# Altium schematic sheet Power.SchDoc
size A; DocumentNumber: 1; SheetNumber: 1; SheetTotal: 6
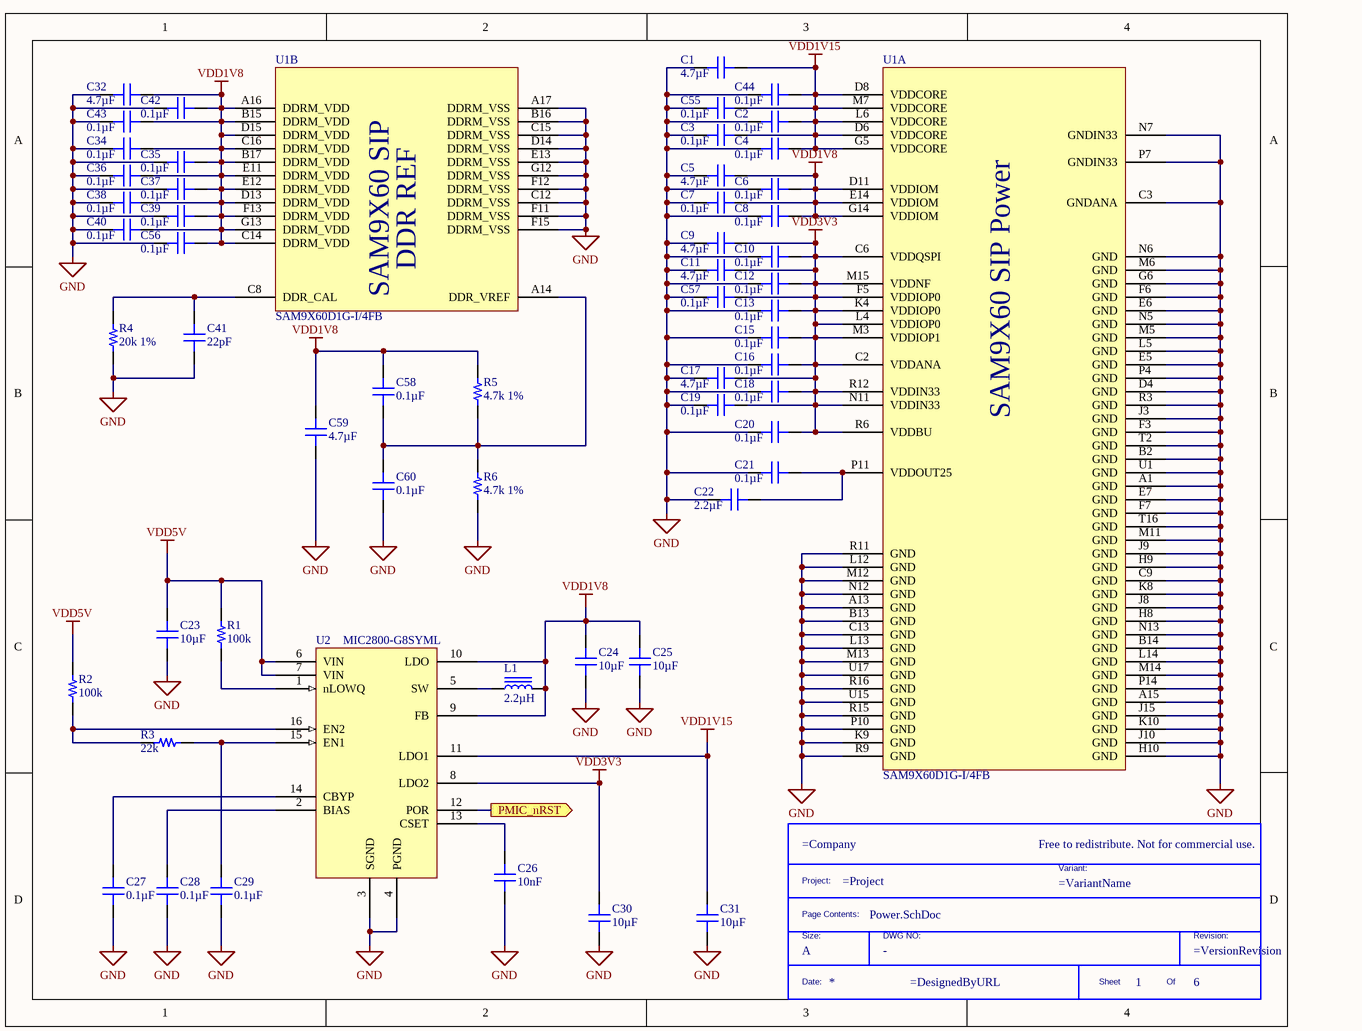
[diagram p0: Power.SchDoc]

## Parts
*  Size: A  (hidden comment: TitleBlock)  (graphical)
C1  4.7µF  [CAP 0402_1005]
C2  0.1µF  [CAP 0402_1005]
C3  0.1µF  [CAP 0402_1005]
C4  0.1µF  [CAP 0402_1005]
C5  4.7µF  [CAP 0402_1005]
C6  0.1µF  [CAP 0402_1005]
C7  0.1µF  [CAP 0402_1005]
C8  0.1µF  [CAP 0402_1005]
C9  4.7µF  [CAP 0402_1005]
C10  0.1µF  [CAP 0402_1005]
C11  4.7µF  [CAP 0402_1005]
C12  0.1µF  [CAP 0402_1005]
C13  0.1µF  [CAP 0402_1005]
C15  0.1µF  [CAP 0402_1005]
C16  0.1µF  [CAP 0402_1005]
C17  4.7µF  [CAP 0402_1005]
C18  0.1µF  [CAP 0402_1005]
C19  0.1µF  [CAP 0402_1005]
C20  0.1µF  [CAP 0402_1005]
C21  0.1µF  [CAP 0402_1005]
C22  2.2µF  [CAP 0402_1005]
C23  10µF  [CAP 0805_2012]
C24  10µF  [CAP 0805_2012]
C25  10µF  [CAP 0805_2012]
C26  10nF  [CAP 0402_1005]
C27  0.1µF  [CAP 0402_1005]
C28  0.1µF  [CAP 0402_1005]
C29  0.1µF  [CAP 0402_1005]
C30  10µF  [CAP 0805_2012]
C31  10µF  [CAP 0805_2012]
C32  4.7µF  [CAP 0402_1005]
C34  0.1µF  [CAP 0402_1005]
C35  0.1µF  [CAP 0402_1005]
C36  0.1µF  [CAP 0402_1005]
C37  0.1µF  [CAP 0402_1005]
C38  0.1µF  [CAP 0402_1005]
C39  0.1µF  [CAP 0402_1005]
C40  0.1µF  [CAP 0402_1005]
C41  22pF  [CAP 0402_1005]
C42  0.1µF  [CAP 0402_1005]
C43  0.1µF  [CAP 0402_1005]
C44  0.1µF  [CAP 0402_1005]
C55  0.1µF  [CAP 0402_1005]
C56  0.1µF  [CAP 0402_1005]
C57  0.1µF  [CAP 0402_1005]
C58  0.1µF  [CAP 0402_1005]
C59  4.7µF  [CAP 0402_1005]
C60  0.1µF  [CAP 0402_1005]
L1  2.2µH  [IND 0806_2016]
R1  100k  [RES 0402_1005]
R2  100k  [RES 0402_1005]
R3  22k  [RES 0402_1005]
R4  20k 1%  [RES 0402_1005]
R5  4.7k 1%  [RES 0402_1005]
R6  4.7k 1%  [RES 0402_1005]
U1  SAM9X60D1G-I/4FB  [BGA233C80P17X17_1400X1400X120]  (parts A,B of 7)
U2  MIC2800-G8SYML  [QFN50P300X300X90-16N]

## Ports
PMIC_nRST (out)

## Nets
GND: C1.1 C2.2 C3.2 C4.2 C5.1 C6.2 C7.2 C8.2 C9.1 C10.2 C11.1 C12.2 C13.2 C15.2 C16.2 C17.1 C18.2 C19.2 C20.2 C21.2 C22.2 C23.1 C24.1 C25.1 C26.1 C27.1 C28.1 C29.1 C30.1 C31.1 C32.1 C34.2 C35.2 C36.2 C37.2 C38.2 C39.2 C40.2 C41.1 C42.2 C43.2 C44.2 C55.2 C56.2 C57.2 C59.1 C60.2 R4.1 R6.1 U1.A1(GND) U1.A13(GND) U1.A15(GND) U1.A17(DDRM_VSS) U1.B2(GND) U1.B13(GND) U1.B14(GND) U1.B16(DDRM_VSS) U1.C3(GNDANA) U1.C9(GND) U1.C12(DDRM_VSS) U1.C13(GND) U1.C15(DDRM_VSS) U1.D4(GND) U1.D14(DDRM_VSS) U1.E5(GND) U1.E6(GND) U1.E7(GND) U1.E13(DDRM_VSS) U1.F3(GND) U1.F6(GND) U1.F7(GND) U1.F11(DDRM_VSS) U1.F12(DDRM_VSS) U1.F15(DDRM_VSS) U1.G6(GND) U1.G12(DDRM_VSS) U1.H8(GND) U1.H9(GND) U1.H10(GND) U1.J3(GND) U1.J8(GND) U1.J9(GND) U1.J10(GND) U1.J15(GND) U1.K8(GND) U1.K9(GND) U1.K10(GND) U1.L5(GND) U1.L12(GND) U1.L13(GND) U1.L14(GND) U1.M5(GND) U1.M6(GND) U1.M11(GND) U1.M12(GND) U1.M13(GND) U1.M14(GND) U1.N5(GND) U1.N6(GND) U1.N7(GNDIN33) U1.N12(GND) U1.N13(GND) U1.P4(GND) U1.P7(GNDIN33) U1.P10(GND) U1.P14(GND) U1.R3(GND) U1.R9(GND) U1.R11(GND) U1.R15(GND) U1.R16(GND) U1.T2(GND) U1.T16(GND) U1.U1(GND) U1.U15(GND) U1.U17(GND) U2.3(SGND) U2.4(PGND)
VDD1V8: C5.2 C6.1 C7.1 C8.1 C24.2 C25.2 C32.2 C34.1 C35.1 C36.1 C37.1 C38.1 C39.1 C40.1 C42.1 C43.1 C56.1 C58.1 C59.2 L1.2 R5.2 U1.A16(DDRM_VDD) U1.B15(DDRM_VDD) U1.B17(DDRM_VDD) U1.C14(DDRM_VDD) U1.C16(DDRM_VDD) U1.D11(VDDIOM) U1.D13(DDRM_VDD) U1.D15(DDRM_VDD) U1.E11(DDRM_VDD) U1.E12(DDRM_VDD) U1.E14(VDDIOM) U1.F13(DDRM_VDD) U1.G13(DDRM_VDD) U1.G14(VDDIOM) U2.9(FB) U2.10(LDO)
VDD1V15: C1.2 C2.1 C3.1 C4.1 C31.2 C44.1 C55.1 U1.D6(VDDCORE) U1.D8(VDDCORE) U1.G5(VDDCORE) U1.L6(VDDCORE) U1.M7(VDDCORE) U2.11(LDO1)
VDD3V3: C9.2 C10.1 C11.2 C12.1 C13.1 C15.1 C16.1 C17.2 C18.1 C19.1 C20.1 C30.2 C57.1 U1.C2(VDDANA) U1.C6(VDDQSPI) U1.F5(VDDIOP0) U1.K4(VDDIOP0) U1.L4(VDDIOP0) U1.M3(VDDIOP1) U1.M15(VDDNF) U1.N11(VDDIN33) U1.R6(VDDBU) U1.R12(VDDIN33) U2.8(LDO2)
VDD5V: C23.2 R1.2 R2.2 U2.6(VIN) U2.7(VIN)
PMIC_nRST: U2.12(POR) ; port PMIC_nRST
NetC21_1: C21.1 C22.1 U1.P11(VDDOUT25)
NetC26_2: C26.2 U2.13(CSET)
NetC27_2: C27.2 U2.14(CBYP)
NetC28_2: C28.2 U2.2(BIAS)
NetC29_2: C29.2 R3.1 U2.15(EN1)
NetC41_2: C41.2 R4.2 U1.C8(DDR_CAL)
NetC58_2: C58.2 C60.1 R5.1 R6.2 U1.A14(DDR_VREF)
NetL1_1: L1.1 U2.5(SW)
NetR1_1: R1.1 U2.1(nLOWQ)
NetR2_1: R2.1 R3.2 U2.16(EN2)

## Notes on the sheet
- (in symbol SAM9X60D1G-I/4FB, part A) SAM9X60 SIP Power
- (in symbol SAM9X60D1G-I/4FB, part B) DDR REF; SAM9X60 SIP
- (in symbol TitleBlock) Free to redistribute. Not for commercial use.; Project:; Variant:; Page Contents:; Size:; DWG NO:; Revision:; Date:; Sheet; Of

## Library data of the parts
* = TitleBlock: Custom Title Block; DWG: -
C1 C5 C9 C11 C17 C32 C59 = CL05A475KP5NRNC: CAP CER 4.7UF 10V X5R 0402; Manufacturer: Samsung Electro-Mechanics; Tolerance: ±10%; Part Number: CL05A475KP5NRNC; Value: 4.7µF; Applications: General Purpose; Capacitance: 4.7µF; ComponentLink1Description: Datasheet; ComponentLink1URL: http://www.samsungsem.com/kr/support/product-search/mlcc/CL05A475KP5NRNC.jsp; ComponentLink2Description: DigiKey Link; ComponentLink2URL: http://digikey.com/product-detail/en/samsung-electro-mechanics/CL05A475KP5NRNC/1276-1480-1-ND/3889566; Device Package: 0402 (1005 Metric); LastUpdated: 9/2/2020 1:02:23 AM; Lifecycle Status: Active; Minimum Order: 1; Mounting Type: Surface Mount, MLCC; Operating Temperature: -55°C ~ 85°C; Package / Case: 0402 (1005 Metric); Packaging: TapeAndReel; PartId: 2191; Part Status: Active; Price: 0.08; Series: CL; Size / Dimension: 0.039" L x 0.020" W (1.00mm x 0.50mm); Supplier 1: DigiKey; Supplier Part Number 1: 1276-1480-1-ND; Temperature Coefficient: X5R; Thickness (Max): 0.022" (0.55mm); Voltage - Rated: 10V
C2-C4 C6-C8 C10 C12 C13 C15 C16 C18-C21 C27-C29 C34-C40 C42-C44 C55-C58 C60 = C0402C104K4PACTU: CAP CER 0.1UF 16V X5R 0402; Manufacturer: KEMET; Tolerance: ±10%; Part Number: C0402C104K4PACTU; Value: 0.1µF; Applications: General Purpose; Capacitance: 0.1µF; ComponentLink1Description: Datasheet; ComponentLink1URL: https://api.kemet.com/component-edge/download/datasheet/C0402C104K4PACTU.pdf; ComponentLink2Description: DigiKey Link; ComponentLink2URL: http://digikey.com/product-detail/en/kemet/C0402C104K4PACTU/399-7762-1-ND/3471485; Device Package: 0402 (1005 Metric); LastUpdated: 9/2/2020 1:02:03 AM; Lifecycle Status: Active; Minimum Order: 1; Mounting Type: Surface Mount, MLCC; Operating Temperature: -55°C ~ 85°C; Package / Case: 0402 (1005 Metric); Packaging: TapeAndReel; PartId: 11334; Part Status: Active; Price: 0.01; Series: SMD Comm X5R; Size / Dimension: 0.039" L x 0.020" W (1.00mm x 0.50mm); Supplier 1: DigiKey; Supplier Part Number 1: 399-7762-1-ND; Temperature Coefficient: X5R; Thickness (Max): 0.022" (0.55mm); Voltage - Rated: 16V
C22 = C1005X5R1A225K050BC: CAP CER 2.2UF 10V X5R 0402; Manufacturer: TDK Corporation; Tolerance: ±10%; Part Number: C1005X5R1A225K050BC; Value: 2.2µF; Applications: General Purpose; Capacitance: 2.2µF; ComponentLink1Description: Datasheet; ComponentLink1URL: https://product.tdk.com/info/en/catalog/datasheets/mlcc_commercial_general_en.pdf?ref_disty=digikey; ComponentLink2Description: DigiKey Link; ComponentLink2URL: http://digikey.com/product-detail/en/tdk-corporation/C1005X5R1A225K050BC/445-7392-1-ND/2733464; Device Package: 0402 (1005 Metric); Features: Low ESL; LastUpdated: 9/2/2020 1:02:23 AM; Lifecycle Status: Active; Minimum Order: 1; Mounting Type: Surface Mount, MLCC; Operating Temperature: -55°C ~ 85°C; Package / Case: 0402 (1005 Metric); Packaging: TapeAndReel; PartId: 2144; Part Status: Active; Price: 0.07; Series: C; Size / Dimension: 0.039" L x 0.020" W (1.00mm x 0.50mm); Supplier 1: DigiKey; Supplier Part Number 1: 445-7392-1-ND; Temperature Coefficient: X5R; Thickness (Max): 0.022" (0.55mm); Voltage - Rated: 10V
C23-C25 C30 C31 = CL21A106KPCLQNC: CAP CER 10UF 10V X5R 0805; Manufacturer: Samsung Electro-Mechanics; Tolerance: ±10%; Part Number: CL21A106KPCLQNC; Value: 10µF; Applications: General Purpose; Capacitance: 10µF; ComponentLink1Description: Datasheet; ComponentLink1URL: http://www.samsungsem.com/kr/support/product-search/mlcc/CL21A106KPCLQNC.jsp; ComponentLink2Description: DigiKey Link; ComponentLink2URL: http://digikey.com/product-detail/en/samsung-electro-mechanics/CL21A106KPCLQNC/1276-2402-1-ND/3890488; Device Package: 0805 (2012 Metric); LastUpdated: 9/2/2020 1:04:19 AM; Lifecycle Status: Active; Minimum Order: 1; Mounting Type: Surface Mount, MLCC; Operating Temperature: -55°C ~ 85°C; Package / Case: 0805 (2012 Metric); Packaging: TapeAndReel; PartId: 14319; Part Status: Active; Price: 0.03; Series: CL; Size / Dimension: 0.079" L x 0.049" W (2.00mm x 1.25mm); Supplier 1: DigiKey; Supplier Part Number 1: 1276-2402-1-ND; Temperature Coefficient: X5R; Thickness (Max): 0.037" (0.95mm); Voltage - Rated: 10V
C26 = C0402C103K4RECAUTO: CAP CER 0402 10NF 16V X7R 10%; Manufacturer: KEMET; Capacitance: 10000pF; Part Number: C0402C103K4RECAUTO; Value: 10nF; Applications: Automotive, ESD Protection; ComponentLink1Description: Datasheet; ComponentLink1URL: https://api.kemet.com/component-edge/download/datasheet/C0402C103K4RECAUTO.pdf; ComponentLink2Description: DigiKey Link; ComponentLink2URL: http://digikey.com/product-detail/en/kemet/C0402C103K4RECAUTO/399-17876-1-ND/8640543; Device Package: 0402 (1005 Metric); LastUpdated: 9/2/2020 1:02:25 AM; Lifecycle Status: Active; Minimum Order: 1; Mounting Type: Surface Mount, MLCC; Operating Temperature: -55°C ~ 125°C; Package / Case: 0402 (1005 Metric); Packaging: TapeAndReel; PartId: 1725; Part Status: Active; Price: 0.02; Ratings: AEC-Q200; Series: ESD SMD Auto X7R; Size / Dimension: 0.039" L x 0.020" W (1.00mm x 0.50mm); Supplier 1: DigiKey; Supplier Part Number 1: 399-17876-1-ND; Temperature Coefficient: X7R; Thickness (Max): 0.022" (0.55mm); Tolerance: ±10%; Voltage - Rated: 16V
C41 = 0402N220F500CT: CAP CER 22PF 50V C0G/NP0 0402; Manufacturer: Walsin Technology Corporation; Temperature Coefficient: C0G, NP0; Tolerance: ±1%; Part Number: 0402N220F500CT; Value: 22pF; Applications: General Purpose; Capacitance: 22pF; ComponentLink1Description: Datasheet; ComponentLink1URL: http://www.passivecomponent.com/wp-content/uploads/2018/10/MLCC.pdf; ComponentLink2Description: DigiKey Link; ComponentLink2URL: http://digikey.com/product-detail/en/walsin-technology-corporation/0402N220F500CT/1292-1280-1-ND/9355284; Device Package: 0402 (1005 Metric); LastUpdated: 9/2/2020 1:02:14 AM; Lifecycle Status: Active; Minimum Order: 1; Mounting Type: Surface Mount, MLCC; Operating Temperature: -55°C ~ 125°C; Package / Case: 0402 (1005 Metric); Packaging: TapeAndReel; PartId: 6200; Part Status: Active; Price: 0.01; Series: -; Size / Dimension: 0.039" L x 0.020" W (1.00mm x 0.50mm); Supplier 1: DigiKey; Supplier Part Number 1: 1292-1280-1-ND; Thickness (Max): 0.022" (0.55mm); Voltage - Rated: 50V
L1 = CIGT201610EH2R2MNE: FIXED IND 2.2UH 2.5A 87MOHM SMD; Manufacturer: Samsung Electro-Mechanics; Current - Saturation: 2.9A; DC Resistance (DCR): 87mOhm Max; Inductance Frequency - Test: 1MHz; Material - Core: Metal Composite; Shielding: Unshielded; Tolerance: ±20%; Type: Thin Film; Part Number: CIGT201610EH2R2MNE; ComponentLink1Description: Datasheet; ComponentLink1URL: http://www.samsungsem.com/kr/support/product-search/inductor/CIGT201610EH2R2MNE.jsp; ComponentLink2Description: DigiKey Link; ComponentLink2URL: http://digikey.com/product-detail/en/samsung-electro-mechanics/CIGT201610EH2R2MNE/1276-6901-1-ND/7041301; Current Rating (Amps): 2.5A; Device Package: 0806 (2016 Metric); Height - Seated (Max): 0.039" (1.00mm); Inductance: 2.2µH; LastUpdated: 9/2/2020 1:24:36 AM; Lifecycle Status: Active; Minimum Order: 1; Mounting Type: Surface Mount; Operating Temperature: -40°C ~ 125°C; Package / Case: 0806 (2016 Metric); Packaging: TapeAndReel; PartId: 3766; Part Status: Active; Price: 0.11; Series: CIGT; Size / Dimension: 0.079" L x 0.063" W (2.00mm x 1.60mm); Supplier 1: DigiKey; Supplier Part Number 1: 1276-6901-1-ND; Supplier Device Package: 0806 (2016 Metric); Value: 2.2µH
R1 R2 = CRCW0402100KFKEDC: RES SMD 100K OHM 1% 1/16W 0402; Manufacturer: Vishay Dale; Power (Watts): 0.063W, 1/16W; Resistance: 100 kOhms; Temperature Coefficient: ±100ppm/°C; Part Number: CRCW0402100KFKEDC; Value: 100k; ComponentLink1Description: Datasheet; ComponentLink1URL: http://www.vishay.com/docs/28773/crcwce3.pdf; ComponentLink2Description: DigiKey Link; ComponentLink2URL: http://digikey.com/product-detail/en/vishay-dale/CRCW0402100KFKEDC/541-3960-1-ND/7928643; Composition: Thick Film; Device Package: 0402 (1005 Metric); Height - Seated (Max): 0.014" (0.35mm); LastUpdated: 9/2/2020 1:07:49 AM; Lifecycle Status: Active; Minimum Order: 1; Number of Terminations: 2; Operating Temperature: -55°C ~ 155°C; Package / Case: 0402 (1005 Metric); Packaging: CutTape; PartId: 12665; Part Status: Active; Price: 0.10; Series: CRCW-C; Size / Dimension: 0.039" L x 0.020" W (1.00mm x 0.50mm); Supplier 1: DigiKey; Supplier Part Number 1: 541-3960-1-ND; Supplier Device Package: 0402; Tolerance: ±1%
R3 = CR0402-FX-2202GLF: RES SMD 22K OHM 1% 1/16W 0402; Manufacturer: Bourns Inc.; Power (Watts): 0.063W, 1/16W; Resistance: 22 kOhms; Temperature Coefficient: ±100ppm/°C; Part Number: CR0402-FX-2202GLF; Value: 22k; ComponentLink1Description: Datasheet; ComponentLink1URL: https://www.bourns.com/docs/Product-Datasheets/CR0402.pdf; ComponentLink2Description: DigiKey Link; ComponentLink2URL: http://digikey.com/product-detail/en/bourns-inc/CR0402-FX-2202GLF/CR0402-FX-2202GLFCT-ND/4247665; Composition: Thick Film; Device Package: 0402 (1005 Metric); Height - Seated (Max): 0.016" (0.40mm); LastUpdated: 9/2/2020 1:08:01 AM; Lifecycle Status: Active; Minimum Order: 1; Number of Terminations: 2; Operating Temperature: -55°C ~ 155°C; Package / Case: 0402 (1005 Metric); Packaging: CutTape; PartId: 6638; Part Status: Active; Price: 0.10; Series: CR0402; Size / Dimension: 0.039" L x 0.020" W (1.00mm x 0.50mm); Supplier 1: DigiKey; Supplier Part Number 1: CR0402-FX-2202GLFCT-ND; Supplier Device Package: 0402; Tolerance: ±1%
R4 = CR0402-FX-2002GLF: RES SMD 20K OHM 1% 1/16W 0402; Manufacturer: Bourns Inc.; Power (Watts): 0.063W, 1/16W; Resistance: 20 kOhms; Temperature Coefficient: ±100ppm/°C; Part Number: CR0402-FX-2002GLF; Value: 20k 1%; ComponentLink1Description: Datasheet; ComponentLink1URL: https://www.bourns.com/docs/Product-Datasheets/CR0402.pdf; ComponentLink2Description: DigiKey Link; ComponentLink2URL: http://digikey.com/product-detail/en/bourns-inc/CR0402-FX-2002GLF/CR0402-FX-2002GLFCT-ND/3740845; Composition: Thick Film; Device Package: 0402 (1005 Metric); Height - Seated (Max): 0.016" (0.40mm); LastUpdated: 9/2/2020 1:08:01 AM; Lifecycle Status: Active; Minimum Order: 1; Number of Terminations: 2; Operating Temperature: -55°C ~ 155°C; Package / Case: 0402 (1005 Metric); Packaging: CutTape; PartId: 6612; Part Status: Active; Price: 0.10; Series: CR0402; Size / Dimension: 0.039" L x 0.020" W (1.00mm x 0.50mm); Supplier 1: DigiKey; Supplier Part Number 1: CR0402-FX-2002GLFCT-ND; Supplier Device Package: 0402; Tolerance: ±1%
R5 R6 = CR0402-FX-4701GLF: RES SMD 4.7K OHM 1% 1/16W 0402; Manufacturer: Bourns Inc.; Power (Watts): 0.063W, 1/16W; Resistance: 4.7 kOhms; Temperature Coefficient: ±100ppm/°C; Part Number: CR0402-FX-4701GLF; Value: 4.7k 1%; ComponentLink1Description: Datasheet; ComponentLink1URL: https://www.bourns.com/docs/Product-Datasheets/CR0402.pdf; ComponentLink2Description: DigiKey Link; ComponentLink2URL: http://digikey.com/product-detail/en/bourns-inc/CR0402-FX-4701GLF/CR0402-FX-4701GLFCT-ND/3740849; Composition: Thick Film; Device Package: 0402 (1005 Metric); Height - Seated (Max): 0.016" (0.40mm); LastUpdated: 9/2/2020 1:08:01 AM; Lifecycle Status: Active; Minimum Order: 1; Number of Terminations: 2; Operating Temperature: -55°C ~ 155°C; Package / Case: 0402 (1005 Metric); Packaging: CutTape; PartId: 6504; Part Status: Active; Price: 0.10; Series: CR0402; Size / Dimension: 0.039" L x 0.020" W (1.00mm x 0.50mm); Supplier 1: DigiKey; Supplier Part Number 1: CR0402-FX-4701GLFCT-ND; Supplier Device Package: 0402; Tolerance: ±1%
U1 = SAM9X60D1G-I/4FB: ARM926 MPU, 1GBIT DDR2, BGA, IND TEMP; Manufacturer: Microchip; Manufacturer Part Number: SAM9X60D6K-I/4GB; Supplier 1: Digi-Key; RoHS: No; Category: Microprocessors; Stock 1: 237; Pricing 1: 1=10.63000, 25=9.74040, 100=8.82060 (USD); Supplier Part Number 1: 150-SAM9X60D6K-I/4GB-ND
U2 = MIC2800-G8SYML-TR: DC-DC + 2 Linear Regulators with LowQ Mode & POR 16 VQFN 3x3x0.90mm T/R RoHS Compliant: Yes; Manufacturer: Microchip; Supplier 1: Digi-Key; Manufacturer Part Number: MIC2800-G8SYML-TR; RoHS: Yes; Category: Power Management ICs; Stock 1: 5000; Pricing 1: 5000=1.90500 (USD); Supplier Part Number 1: MIC2800-G8SYML-TR-ND